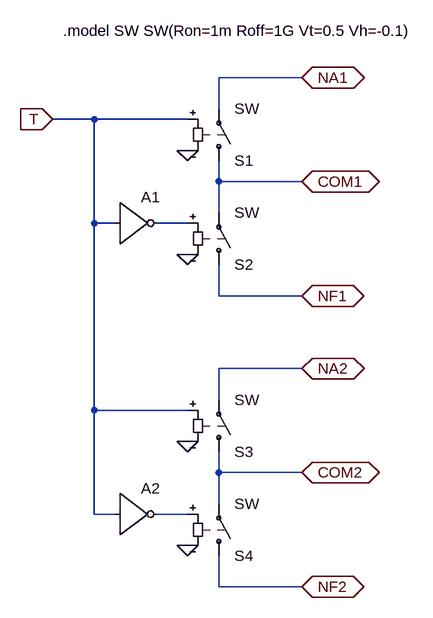
[diagram p0: schematic DPDTg.asc]
DPDTg.asc, the LTspice schematic file:
Version 4
SHEET 1 1008 680
WIRE 320 -176 192 -176
WIRE 192 -128 192 -176
WIRE 0 -112 -64 -112
WIRE 144 -112 0 -112
WIRE 192 -16 192 -48
WIRE 320 -16 192 -16
WIRE 192 32 192 -16
WIRE 0 48 0 -112
WIRE 32 48 0 48
WIRE 144 48 96 48
WIRE 192 160 192 112
WIRE 320 160 192 160
WIRE 320 272 192 272
WIRE 192 320 192 272
WIRE 0 336 0 48
WIRE 144 336 0 336
WIRE 192 432 192 400
WIRE 320 432 192 432
WIRE 192 480 192 432
WIRE 0 496 0 336
WIRE 32 496 0 496
WIRE 144 496 96 496
WIRE 192 608 192 560
WIRE 320 608 192 608
FLAG 144 -64 0
FLAG 144 96 0
FLAG 320 -176 NA1
IOPIN 320 -176 BiDir
FLAG 320 -16 COM1
IOPIN 320 -16 BiDir
FLAG 320 160 NF1
IOPIN 320 160 BiDir
FLAG -64 -112 T
IOPIN -64 -112 In
FLAG 144 384 0
FLAG 144 544 0
FLAG 320 272 NA2
IOPIN 320 272 BiDir
FLAG 320 432 COM2
IOPIN 320 432 BiDir
FLAG 320 608 NF2
IOPIN 320 608 BiDir
SYMBOL sw 192 -32 M180
SYMATTR InstName S1
SYMBOL Digital\\inv 32 -16 R0
SYMATTR InstName A1
SYMBOL sw 192 128 M180
SYMATTR InstName S2
SYMBOL sw 192 416 M180
SYMATTR InstName S3
SYMBOL Digital\\inv 32 432 R0
SYMATTR InstName A2
SYMBOL sw 192 576 M180
SYMATTR InstName S4
TEXT -48 -248 Left 2 !.model SW SW(Ron=1m Roff=1G Vt=0.5 Vh=-0.1)

The netlist it stands for:
* DPDTg.asc
S1 COM1 NA1 T 0 SW
A1 T 0 0 0 0 N001 0 0 BUF
S2 NF1 COM1 N001 0 SW
S3 COM2 NA2 T 0 SW
A2 T 0 0 0 0 N002 0 0 BUF
S4 NF2 COM2 N002 0 SW
.model SW SW(Ron=1m Roff=1G Vt=0.5 Vh=-0.1)
.backanno
.end